# EAGLE design switch (EAGLE 6.4)
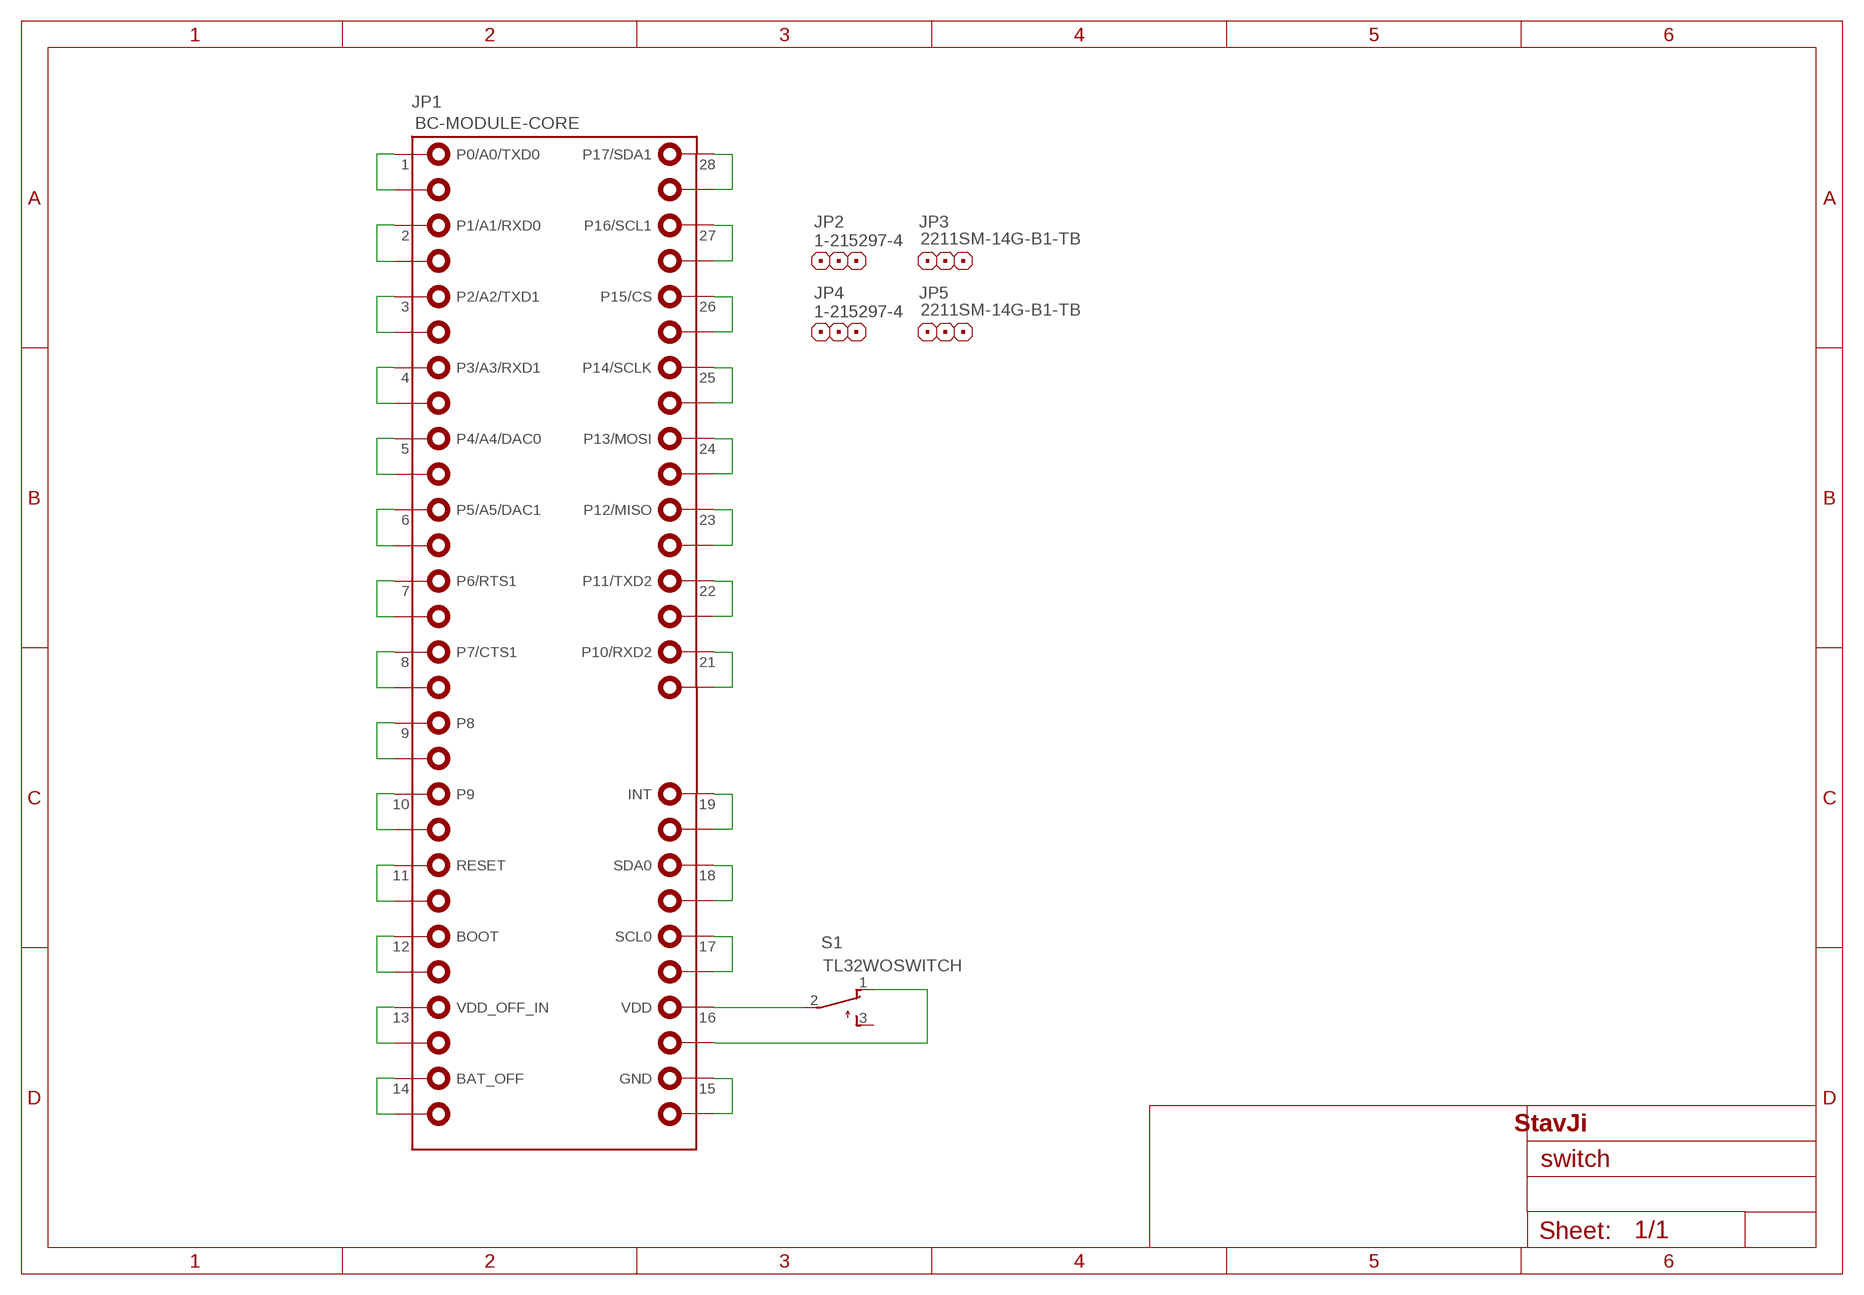
[diagram p0: schematic, sheet 1]

## Parts
JP1  BC-MODULE-CORE  BC-MODULE-CORE-TOP-BOT  [BC-MODULE-CORE-SMD-TOP-BOT]
JP2  1-215297-4  1X3  [1X14_WITHOUT_PAD]
JP3  2211SM-14G-B1-TB  1X3  [1X14_WITHOUT_PAD]
JP4  1-215297-4  1X3  [1X14_WITHOUT_PAD]
JP5  2211SM-14G-B1-TB  1X3  [1X14_WITHOUT_PAD]
S1  TL32WOSWITCH  [SWITCH]

## Nets
N$1: JP1.1(P0/A0/TXD0) JP1.1B(P0/A0/TXD0_B)
N$2: JP1.2(P1/A1/RXD0) JP1.2B(P1/A1/RXD0_B)
N$3: JP1.3(P2/A2/TXD1) JP1.3B(P2/A2/TXD1_B)
N$4: JP1.4(P3/A3/RXD1) JP1.4B(P3/A3/RXD1_B)
N$5: JP1.5(P4/A4/DAC0) JP1.5B(P4/A4/DAC0_B)
N$6: JP1.6(P5/A5/DAC1) JP1.6B(P5/A5/DAC1_B)
N$7: JP1.7(P6/RTS1) JP1.7B(P6/RTS1_B)
N$8: JP1.8(P7/CTS1) JP1.8B(P7/CTS1_B)
N$9: JP1.9(P8) JP1.9B(P8_B)
N$10: JP1.10(P9) JP1.10B(P9_B)
N$11: JP1.11(RESET) JP1.11B(RESET_B)
N$12: JP1.12(BOOT) JP1.12B(BOOT_B)
N$13: JP1.13(VDD_OFF_IN) JP1.13B(VDD_OFF_IN_B)
N$14: JP1.14(BAT_OFF) JP1.14B(BAT_OFF_B)
N$15: JP1.28(P17/SDA1) JP1.28B(P17/SDA1_B)
N$16: JP1.27(P16/SCL1) JP1.27B(P16/SCL1_B)
N$17: JP1.26(P15/CS) JP1.26B(P15/CS_B)
N$18: JP1.25(P14/SCLK) JP1.25B(P14/SCLK_B)
N$19: JP1.24(P13/MOSI) JP1.24B(P13/MOSI_B)
N$20: JP1.23(P12/MISO) JP1.23B(P12/MISO_B)
N$21: JP1.22(P11/TXD2) JP1.22B(P11/TXD2_B)
N$22: JP1.21(P10/RXD2) JP1.21B(P10/RXD2_B)
N$23: JP1.19(INT) JP1.19B(INT_B)
N$24: JP1.18(SDA0) JP1.18B(SDA0_B)
N$25: JP1.17(SCL0) JP1.17B(SCL0_B)
N$26: JP1.15(GND) JP1.15B(GND_B)
N$32: JP1.16B(VDD_B) S1.1(O)
N$33: JP1.16(VDD) S1.2(P)
Unconnected: S1.3(S)

## Notes on the sheet
- StavJi

## Library data of the parts
JP1 = bigclown:BC-MODULE-CORE-TOP-BOT
JP2-JP5 = pinhead:1X3
S1 = switch:TL32WO: TINY SWITCH ON - MOM Source: http://www2.produktinfo.conrad.com/datenblaetter/700000-724999/705152-da-01-de-Subminiaturschalter_TL_36WO.pdf

## Board
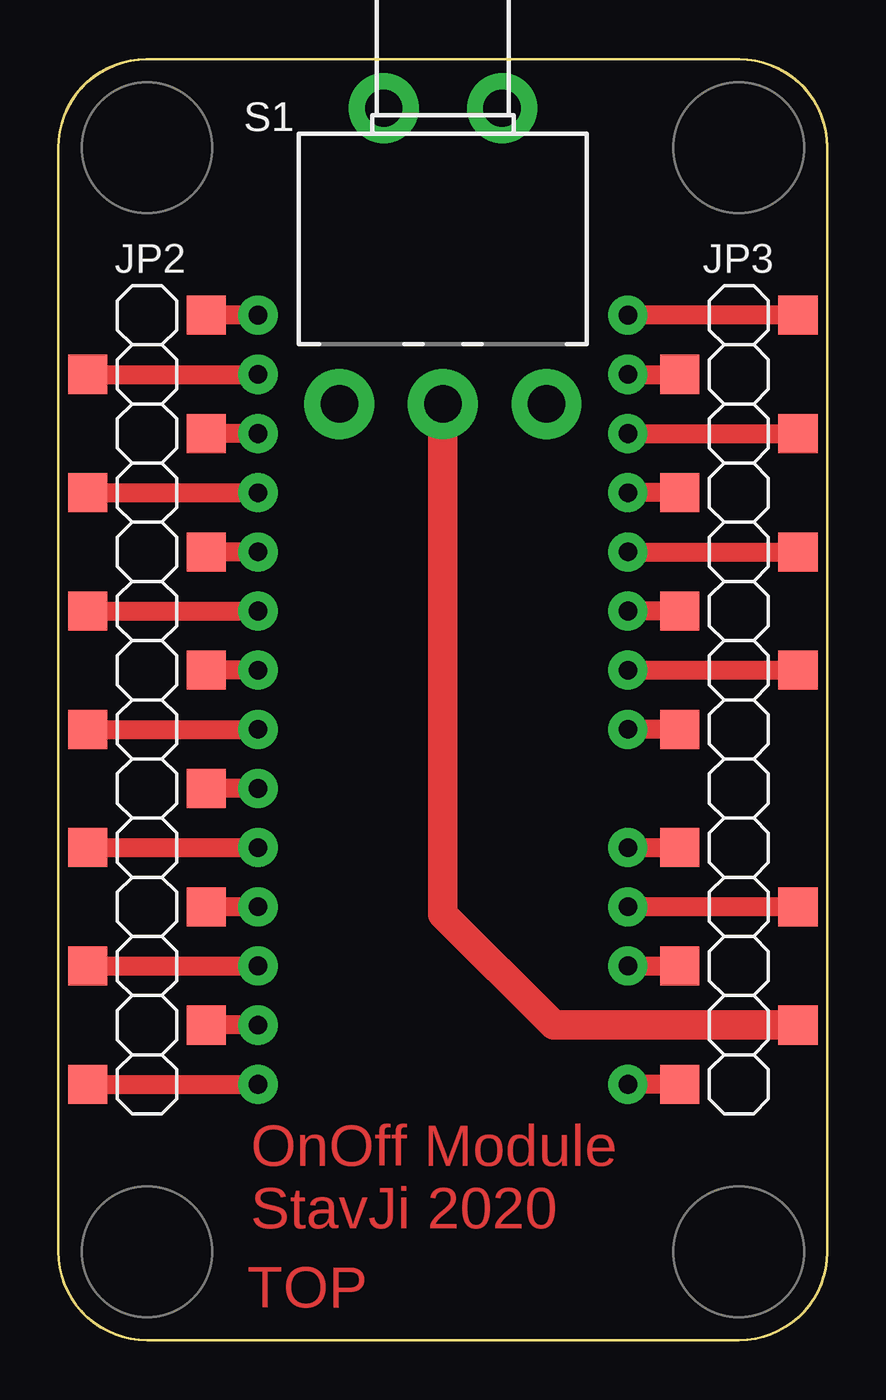
[diagram p1: board, top side]
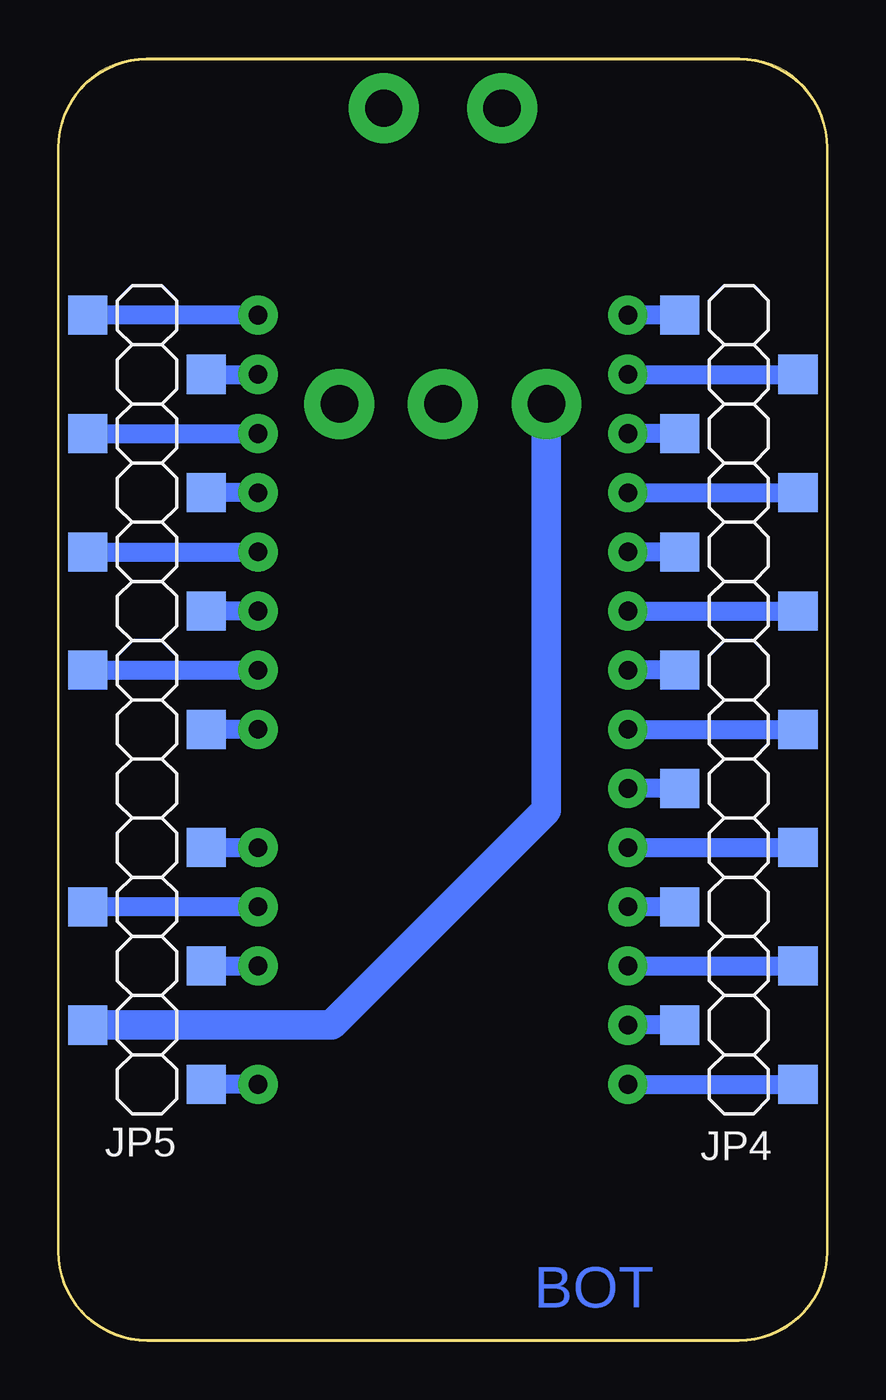
[diagram p2: board, bottom side, seen from below]

Size 33.02 x 55.09 mm. Coordinates in mm from the lower left corner, seen from the top.
Outline: 29.22,0 3.79,0 arc-90 0,3.79 0,51.32 arc-90 3.77,55.09 29.24,55.09 arc-90 33.02,51.31 33.02,3.8 arc-90 29.22,0
Copper layers (1*16): Top 0.035mm / dielectric 1.5mm / Bottom 0.035mm
Design rules "default *": minimum track width 10mil, minimum drill 24mil, track to track 8mil, track to pad 8mil, pad to pad 8mil, via to via 8mil, smd to smd 8mil, copper to edge 40mil, drill to drill 8mil, minimum pad ring 10mil, minimum via ring 8mil, stop-mask expansion 4mil, vias tented up to drill 50mil, thermal gap 10mil

### Footprints (pad centres in the part's own frame; a part is rotated, then mirrored left to right if it is on the bottom)
BC-MODULE-CORE-SMD-TOP-BOT = smd 1.676 x 1.676: 1 -10.16,16.51; 2 -15.24,13.97; 3 -10.16,11.43; 4 -15.24,8.89; 5 -10.16,6.35; 6 -15.24,3.81; 7 -10.16,1.27; 8 -15.24,-1.27; 9 -10.16,-3.81; 10 -15.24,-6.35; 11 -10.16,-8.89; 12 -15.24,-11.43; 13 -10.16,-13.97; 14 -15.24,-16.51; 15 10.16,-16.51; 16 15.24,-13.97; 17 10.16,-11.43; 18 15.24,-8.89; 19 10.16,-6.35; 21 10.16,-1.27; 22 15.24,1.27; 23 10.16,3.81; 24 15.24,6.35; 25 10.16,8.89; 26 15.24,11.43; 27 10.16,13.97; 28 15.24,16.51; VKJ1 -10.16,-3.81 | smd 1.676 x 1.676 bottom: 1B -10.16,16.51; 2B -15.24,13.97; 3B -10.16,11.43; 4B -15.24,8.89; 5B -10.16,6.35; 6B -15.24,3.81; 7B -10.16,1.27; 8B -15.24,-1.27; 9B -10.16,-3.81; 10B -15.24,-6.35; 11B -10.16,-8.89; 12B -15.24,-11.43; 13B -10.16,-13.97; 14B -15.24,-16.51; 15B 10.16,-16.51; 16B 15.24,-13.97; 17B 10.16,-11.43; 18B 15.24,-8.89; 19B 10.16,-6.35; 21B 10.16,-1.27; 22B 15.24,1.27; 23B 10.16,3.81; 24B 15.24,6.35; 25B 10.16,8.89; 26B 15.24,11.43; 27B 10.16,13.97; 28B 15.24,16.51
SWITCH = drill 1.6 pad 3: 1 -4.445,-7.62; 2 0,-7.62; 3 4.445,-7.62; M1 -2.54,5.08; M2 2.54,5.08

### Placement (x,y rotation side)
JP1  16.51,27.54 0 top
JP2  3.81,27.54 90 top
JP3  29.21,27.54 90 top
JP4  3.81,27.54 90 bottom
JP5  29.21,27.54 90 bottom
S1  16.51,47.86 0 top

### Tracks (layer width: path | path; a pad name or v marks a point on that pad's centre or on a via)
N$1  (via drill 0.8 pad 1.68)
  Top 0.813: v8.57,44.05 JP1.1B
  Bottom 0.813: JP1.1B v8.57,44.05
N$2  (via drill 0.8 pad 1.68)
  Top 0.813: JP1.2B v8.57,41.51
  Bottom 0.813: v8.57,41.51 JP1.2B
N$3  (via drill 0.8 pad 1.68)
  Top 0.813: v8.57,38.97 JP1.3B
  Bottom 0.813: JP1.3B v8.57,38.97
N$4  (via drill 0.8 pad 1.68)
  Top 0.813: JP1.4B v8.57,36.43
  Bottom 0.813: v8.57,36.43 JP1.4B
N$5  (via drill 0.8 pad 1.68)
  Top 0.813: v8.57,33.89 JP1.5B
  Bottom 0.813: JP1.5B v8.57,33.89
N$6  (via drill 0.8 pad 1.68)
  Top 0.813: JP1.6B v8.57,31.35
  Bottom 0.813: v8.57,31.35 JP1.6B
N$7  (via drill 0.8 pad 1.68)
  Top 0.813: v8.57,28.81 JP1.7B
  Bottom 0.813: JP1.7B v8.57,28.81
N$8  (via drill 0.8 pad 1.68)
  Top 0.813: JP1.8B v8.57,26.27
  Bottom 0.813: v8.57,26.27 JP1.8B
N$9  (via drill 0.8 pad 1.68)
  Top 0.813: v8.57,23.73 JP1.9B
  Bottom 0.813: JP1.9B v8.57,23.73
N$10  (via drill 0.8 pad 1.68)
  Top 0.813: JP1.10B v8.57,21.19
  Bottom 0.813: v8.57,21.19 JP1.10B
N$11  (via drill 0.8 pad 1.68)
  Top 0.813: v8.57,18.65 JP1.11B
  Bottom 0.813: JP1.11B v8.57,18.65
N$12  (via drill 0.8 pad 1.68)
  Top 0.813: JP1.12B v8.57,16.11
  Bottom 0.813: v8.57,16.11 JP1.12B
N$13  (via drill 0.8 pad 1.68)
  Top 0.813: v8.57,13.57 JP1.13B
  Bottom 0.813: JP1.13B v8.57,13.57
N$14  (via drill 0.8 pad 1.68)
  Top 0.813: JP1.14B v8.57,11.03
  Bottom 0.813: v8.57,11.03 JP1.14B
N$15  (via drill 0.8 pad 1.68)
  Top 0.813: JP1.28B v24.45,44.05
  Bottom 0.813: v24.45,44.05 JP1.28B
N$16  (via drill 0.8 pad 1.68)
  Top 0.813: v24.45,41.51 JP1.27B
  Bottom 0.813: JP1.27B v24.45,41.51
N$17  (via drill 0.8 pad 1.68)
  Top 0.813: v24.45,38.97 JP1.26B
  Bottom 0.813: JP1.26B v24.45,38.97
N$18  (via drill 0.8 pad 1.68)
  Top 0.813: JP1.25B v24.45,36.43
  Bottom 0.813: v24.45,36.43 JP1.25B
N$19  (via drill 0.8 pad 1.68)
  Top 0.813: v24.45,33.89 JP1.24B
  Bottom 0.813: JP1.24B v24.45,33.89
N$20  (via drill 0.8 pad 1.68)
  Top 0.813: JP1.23B v24.45,31.35
  Bottom 0.813: v24.45,31.35 JP1.23B
N$21  (via drill 0.8 pad 1.68)
  Top 0.813: v24.45,28.81 JP1.22B
  Bottom 0.813: JP1.22B v24.45,28.81
N$22  (via drill 0.8 pad 1.68)
  Top 0.813: JP1.21B v24.45,26.27
  Bottom 0.813: v24.45,26.27 JP1.21B
N$23  (via drill 0.8 pad 1.68)
  Top 0.813: v24.45,21.19 JP1.19B
  Bottom 0.813: JP1.19B v24.45,21.19
N$24  (via drill 0.8 pad 1.68)
  Top 0.813: JP1.18B v24.45,18.65
  Bottom 0.813: v24.45,18.65 JP1.18B
N$25  (via drill 0.8 pad 1.68)
  Top 0.813: v24.45,16.11 JP1.17B
  Bottom 0.813: JP1.17B v24.45,16.11
N$26  (via drill 0.8 pad 1.68)
  Top 0.813: JP1.15B v24.45,11.03
  Bottom 0.813: v24.45,11.03 JP1.15B
N$32
  Bottom 1.27: JP1.16B 21.27,13.57 12.06,22.78 S1.1
N$33
  Top 1.27: JP1.16 21.27,13.57 16.51,18.34 S1.2

### Text on the board
Top: OnOff Module / StavJi 2020 | TOP
Bottom: BOT